# Altium project PCB_MS.PrjPcb
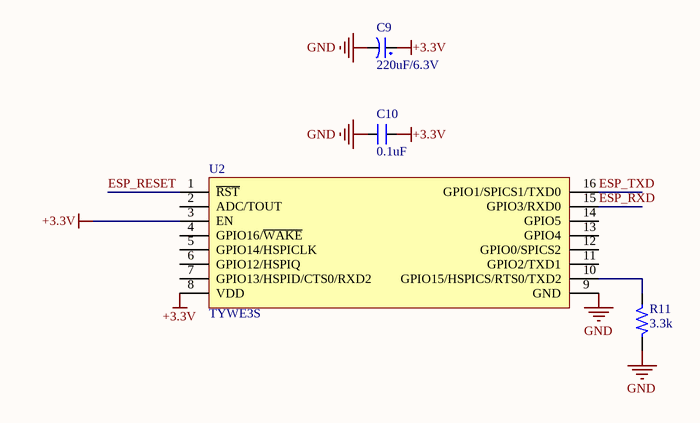
[diagram p0: Wifi.SchDoc]
4 sheets, 40 parts. Net scope: global (net labels, ports and power ports of the same name join across sheets).
Board file: Motion_SS.PcbDoc
Sheets:
  Wifi.SchDoc
  MCU.SchDoc
  Motion_Sensor.SchDoc
  POWER_MS.SchDoc

## Sheet Wifi.SchDoc
size A

### Parts
C9  220uF/6.3V  [C2917]
C10  0.1uF  [C0603]
R11  3.3k  [R0603]
U2  TYWE3S  [ESP_07]

### Nets
+3.3V: C9.1 C10.2 U2.3(EN) U2.8(VDD)
GND: C9.2 C10.1 R11.2 U2.9(GND)
ESP_RESET: U2.1(~{RST})
ESP_RXD: U2.15(GPIO3/RXD0)
ESP_TXD: U2.16(GPIO1/SPICS1/TXD0)
NetR11_1: R11.1 U2.10(GPIO15/HSPICS/RTS0/TXD2)

Not connected (* = marked no-connect by the designer): U2 2(ADC/TOUT) 4(GPIO16/~{WAKE}) 5(GPIO14/HSPICLK) 6(GPIO12/HSPIQ) 7(GPIO13/HSPID/CTS0/RXD2) 11(GPIO2/TXD1) 12(GPIO0/SPICS2) 13(GPIO4) 14(GPIO5)

### Library data of the parts
C9 = CP1: Cap P  0,1uF < 22uF , 16 - 50V; Value: 10uF/50V; Description 1: 10 => 220uF/6,3V/10V - 10uF => 100uF/16V; Description 2: 0,1uF => 33uF/50V - 10uF => 22uF/63V; Description 3: 0,47uF => 10uF/100V
C10 = CM: Cap SMD; Value: 103
R11 = R: Resistor 1/4W; Value: R1/4W - 1K
U2 = ESP_07: ESP-12 Wi-Fi Module by AI-Thinker; IC: ESP8266-EX; Vendor: Ai-thinker; Link: https://world.taobao.com/item/43741891870.htm?spm=a312a.7700714.0.0.F3BsVx#detail

## Sheet MCU.SchDoc
size A
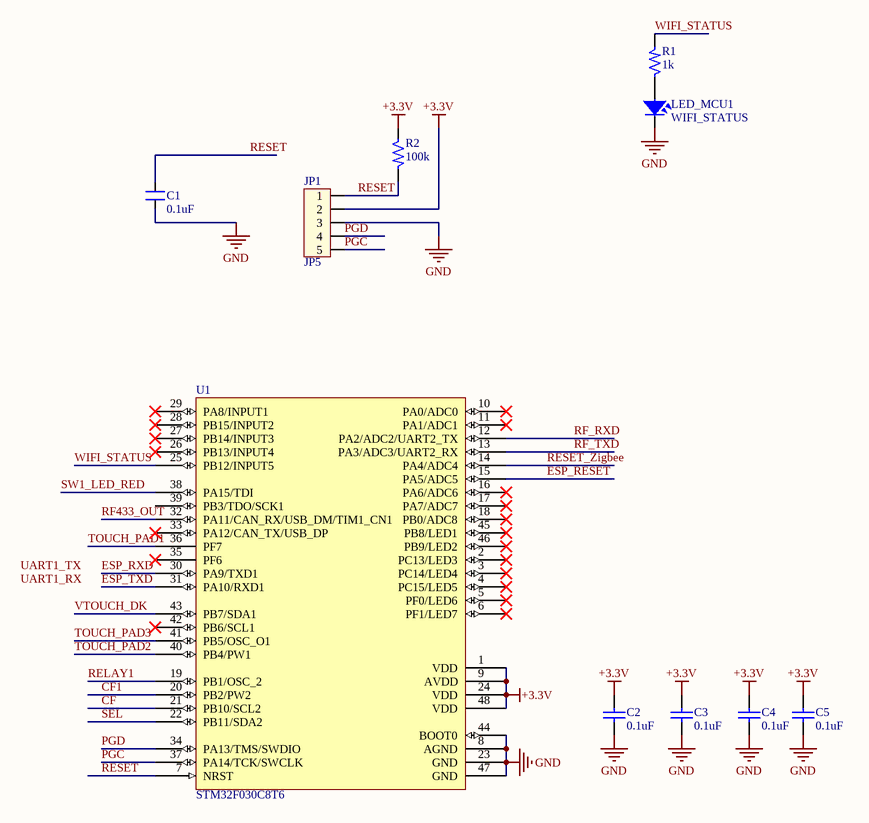
[diagram p1: MCU.SchDoc]

### Parts
C1  0.1uF  [C0603]
C2  0.1uF  [C0603]
C3  0.1uF  [C0603]
C4  0.1uF  [C0603]
C5  0.1uF  [C0603]
JP1  JP5  [HDR1x5]
LED_MCU1  WIFI_STATUS  [R0603]
R1  1k  [R0603]
R2  100k  [R0603]
U1  STM32F030C8T6  [LQFP-48]

### Nets
+3.3V: C2.2 C3.2 C4.2 C5.2 JP1.2 R2.1 U1.1(VDD) U1.9(AVDD) U1.24(VDD) U1.48(VDD)
GND: C1.1 C2.1 C3.1 C4.1 C5.1 JP1.3 LED_MCU1.2 U1.8(AGND) U1.23(GND) U1.44(BOOT0) U1.47(GND)
CF: U1.21(PB10/SCL2)
CF1: U1.20(PB2/PW2)
ESP_RESET: U1.15(PA5/ADC5)
ESP_RXD: U1.30(PA9/TXD1)
ESP_TXD: U1.31(PA10/RXD1)
PGC: JP1.5 U1.37(PA14/TCK/SWCLK)
PGD: JP1.4 U1.34(PA13/TMS/SWDIO)
RELAY1: U1.19(PB1/OSC_2)
RESET: C1.2 JP1.1 R2.2 U1.7(NRST)
RESET_Zigbee: U1.14(PA4/ADC4)
RF433_OUT: U1.32(PA11/CAN_RX/USB_DM/TIM1_CN1)
RF_RXD: U1.12(PA2/ADC2/UART2_TX)
RF_TXD: U1.13(PA3/ADC3/UART2_RX)
SEL: U1.22(PB11/SDA2)
SW1_LED_RED: U1.38(PA15/TDI)
TOUCH_PAD1: U1.36(PF7)
TOUCH_PAD2: U1.40(PB4/PW1)
TOUCH_PAD3: U1.41(PB5/OSC_O1)
VTOUCH_DK: U1.43(PB7/SDA1)
WIFI_STATUS: R1.2 U1.25(PB12/INPUT5)
NetLED_MCU1_1: LED_MCU1.1 R1.1

Not connected (* = marked no-connect by the designer): U1 2(PC13/LED3)* 3(PC14/LED4)* 4(PC15/LED5)* 5(PF0/LED6)* 6(PF1/LED7)* 10(PA0/ADC0)* 11(PA1/ADC1)* 16(PA6/ADC6)* 17(PA7/ADC7)* 18(PB0/ADC8)* 26(PB13/INPUT4)* 27(PB14/INPUT3)* 28(PB15/INPUT2)* 29(PA8/INPUT1)* 33(PA12/CAN_TX/USB_DP)* 35(PF6)* 39(PB3/TDO/SCK1) 42(PB6/SCL1)* 45(PB8/LED1)* 46(PB9/LED2)*

### Notes on the sheet
- Labels drawn without touching a wire or pin: UART1_RX, UART1_TX

### Library data of the parts
C1 = CAP: Cremic For Xtal 1pF => 100pF; Value: 33pF
C2-C5 = Cap Semi: Capacitor (Semiconductor SIM Model); Published: 8-Jun-2000; LatestRevisionDate: 29-May-2009; LatestRevisionNote: IPC-7351 Footprint Added.; PackageReference: C1206; Publisher: Altium Limited; PackageDescription: Chip Capacitor; Value: 0.1uF
JP1 = Con5: Connector 5; Value: Connector 5
LED_MCU1 = LED: LED Single colour Green and Red; Value: LED 3 ly Single Colour
R1 R2 = R: Resistor 1/4W; Value: R1/4W - 1K
U1 = STM32F103C8T6: 32bits STM32 48 Pins; Value: STM32F103C8T6

## Sheet Motion_Sensor.SchDoc
size A2
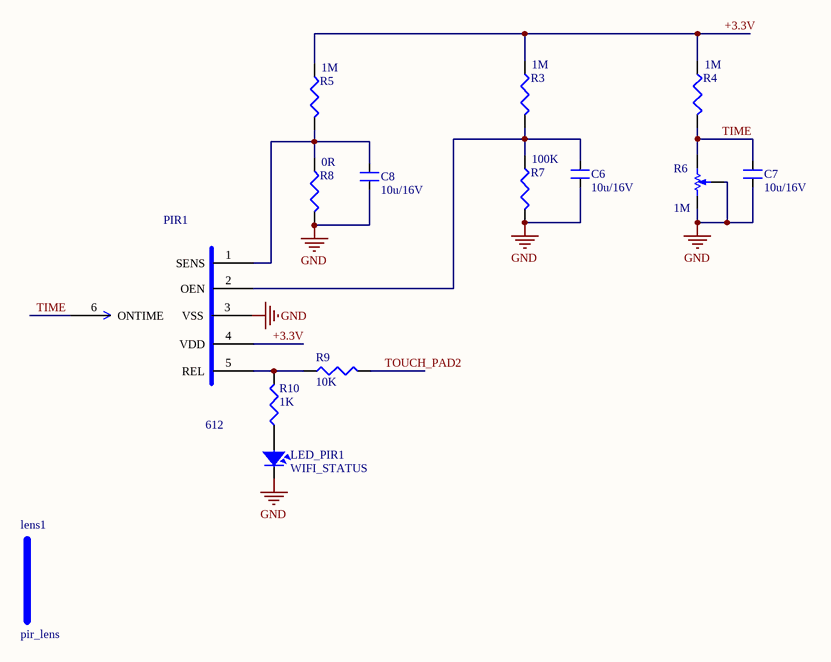
[diagram p2: Motion_Sensor.SchDoc]

### Parts
C6  10u/16V  [SM-0805]
C7  10u/16V  [SM-0805]
C8  10u/16V  [SM-0805]
LED_PIR1  WIFI_STATUS  [R0603]
lens1  pir_lens  [PCBComponent_1]
PIR1  612  [TO5]
R3  1M  [J1-0603]
R4  1M  [J1-0603]
R5  1M  [J1-0603]
R6  1M  [POT4MM-2]
R7  100K  [J1-0603]
R8  0R  [J1-0603]
R9  10K  [J1-0603]
R10  1K  [J1-0603]

### Nets
+3.3V: PIR1.4(VDD) R3.1 R4.1 R5.1
GND: C6.2 C7.2 C8.2 LED_PIR1.2 PIR1.3(VSS) R6.CCW(-) R6.W R7.2 R8.2
TIME: C7.1 PIR1.6(ONTIME) R4.2 R6.CW(+)
TOUCH_PAD2: R9.2
NetC6_1: C6.1 PIR1.2(OEN) R3.2 R7.1
NetC8_1: C8.1 PIR1.1(SENS) R5.2 R8.1
NetLED_PIR1_1: LED_PIR1.1 R10.1
NetPIR1_5: PIR1.5(REL) R9.1 R10.2

### Library data of the parts
C6-C8 = CM: Cap SMD; Value: 103
LED_PIR1 = LED: as LED_MCU1 on sheet MCU
PIR1 = PIR_612
R3-R5 R7-R9 = Res3: Resistor; Value: 1K; Published: 8-Jun-2000; LatestRevisionDate: 29-May-2009; LatestRevisionNote: IPC-7351 Footprint Added.; PackageReference: J1-0603; Publisher: Altium Limited; PackageDescription: Chip Resistor
R6 = RPot SM: Square Trimming Potentiometer; Published: 17-Dec-2003; DatasheetVersion: Oct-2003; PackageReference: POT4MM-2; Publisher: Altium Limited; PackageDescription: Square Trimming Potentiometer; ComponentLink1Description: Manufacturer Link; ComponentLink1URL: http://bourns.com/2/search.html
R10 = Res3: Resistor; Published: 8-Jun-2000; LatestRevisionDate: 29-May-2009; LatestRevisionNote: IPC-7351 Footprint Added.; PackageReference: J1-0603; Publisher: Altium Limited; PackageDescription: Chip Resistor; Value: 1K

## Sheet POWER_MS.SchDoc
size A3
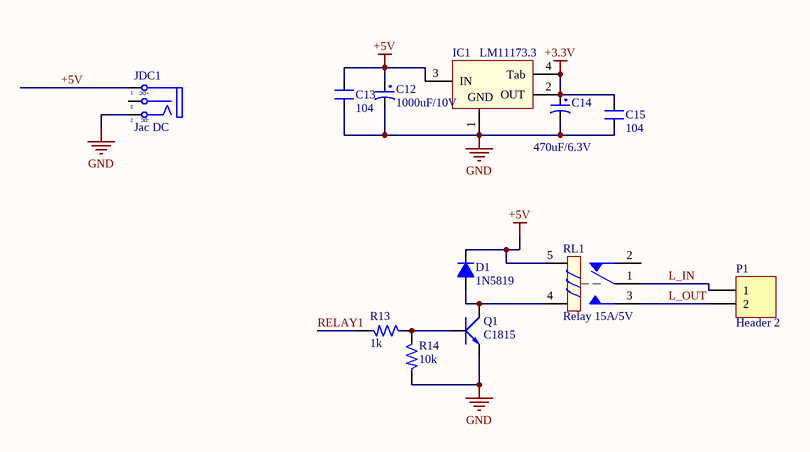
[diagram p3: POWER_MS.SchDoc]

### Parts
C12  1000uF/10V  [CP1.5/3.4]
C13  104  [C0603]
C14  470uF/6.3V  [CP1/2]
C15  104  [C0603]
D1  1N5819  [DO-214AC]
IC1  LM11173.3  [SOT223-4N]
JDC1  Jac DC  [DC-IN]
P1  Header 2  [HDR1X2]
Q1  C1815  [SOT23B]
R13  1k  [R0603]
R14  10k  [R0603]
RL1  Relay 15A/5V  [HF32F-JZC-32F]

### Nets
+3.3V: C14.1 C15.2 IC1.2(OUT) IC1.4(Tab)
+5V: C12.1 C13.2 D1.2(K) IC1.3(IN) JDC1.1(T) RL1.5
GND: C12.2 C13.1 C14.2 C15.1 IC1.1(ADJ/G) JDC1.2(TN) Q1.1(E) R14.2
L_IN: P1.1 RL1.1
L_OUT: P1.2 RL1.3
RELAY1: R13.2
NetD1_1: D1.1(A) Q1.2(C) RL1.4
NetQ1_3: Q1.3(B) R13.1 R14.1

Not connected (* = marked no-connect by the designer): JDC1 3(S); RL1 2

### Notes on the sheet
- (in symbol DCIN) +DC; -DC
- (in symbol LM1117) GND

### Library data of the parts
C12 C14 = CP1: as C9 on sheet Wifi
C13 C15 = CAP: as C1 on sheet MCU
D1 = D1A: Diode 1A; Value: 1N4007
IC1 = LM1117: 3v3; Value: LM317
JDC1 = DCIN: Jac DC input; Value: Jac DC
P1 = Header 2: Header, 2-Pin; LatestRevisionDate: 17-Jul-2002; LatestRevisionNote: Re-released for DXP Platform.; Publisher: Altium Limited
Q1 = C1815: NPN 600mW, ECB; Value: C1815
R13 R14 = R: Resistor 1/4W; Value: R1/4W - 1K
RL1 = Relay 1: Relay SPDT,10A - 12VDC 5 Pin; Value: Relay SPDT, 10A, 12V

## Nets that join several sheets
+3.3V: Wifi (C9.1 C10.2 U2.3 U2.8), MCU (10 pins), Motion_Sensor (PIR1.4 R3.1 R4.1 R5.1), POWER_MS (C14.1 C15.2 IC1.2 IC1.4)
GND: Wifi (C9.2 C10.1 R11.2 U2.9), MCU (11 pins), Motion_Sensor (9 pins), POWER_MS (8 pins)
ESP_RESET: Wifi (U2.1), MCU (U1.15)
ESP_RXD: Wifi (U2.15), MCU (U1.30)
ESP_TXD: Wifi (U2.16), MCU (U1.31)
RELAY1: MCU (U1.19), POWER_MS (R13.2)
TOUCH_PAD2: MCU (U1.40), Motion_Sensor (R9.2)